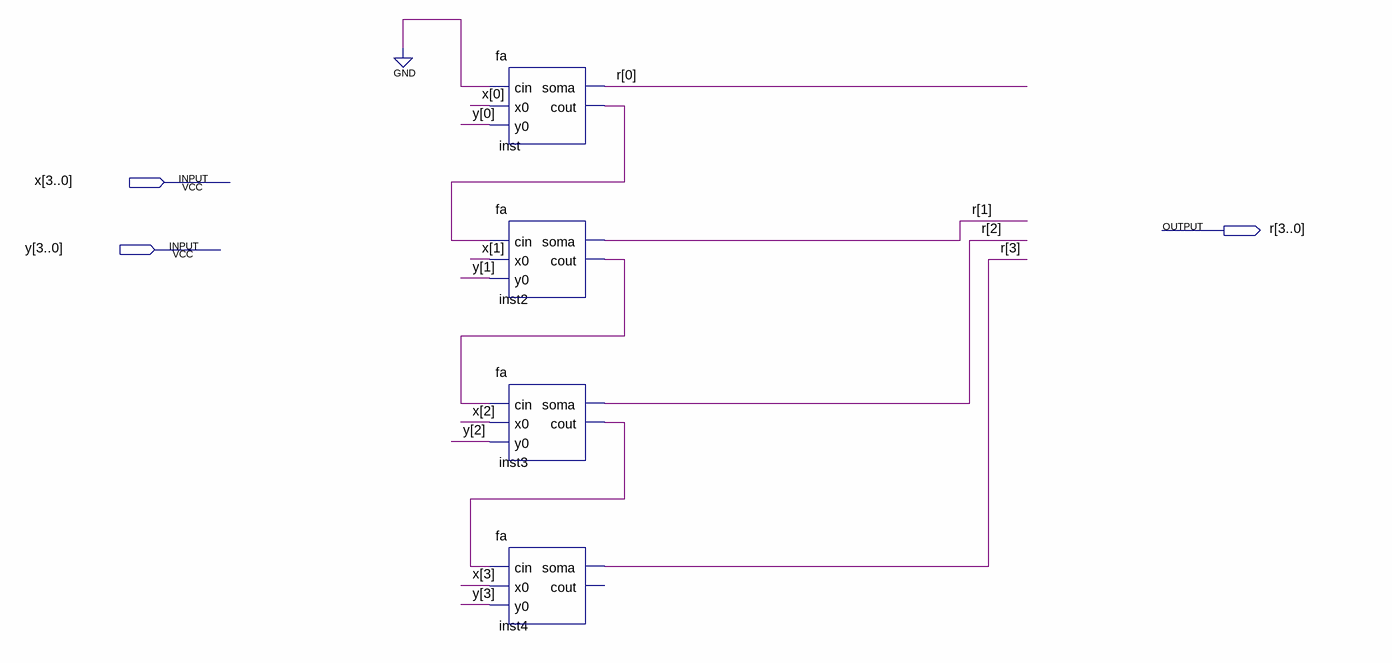
[diagram p0: schematic sheet]
// Quartus schematic somador.bdf as structural Verilog: 4 symbols, 3 pins
module somador (
  input  [3:0] x,
  input  [3:0] y,
  output [3:0] r
);

  wire inst2_cout, inst3_cout, inst_cout;

  fa inst (.cin(1'b0), .x0(x[0]), .y0(y[0]), .soma(r[0]), .cout(inst_cout));
  fa inst2 (.cin(inst_cout), .x0(x[1]), .y0(y[1]), .soma(r[1]), .cout(inst2_cout));
  fa inst3 (.cin(inst2_cout), .x0(x[2]), .y0(y[2]), .soma(r[2]), .cout(inst3_cout));
  fa inst4 (.cin(inst3_cout), .x0(x[3]), .y0(y[3]), .soma(r[3]));  // open: cout
endmodule
